# EAGLE design mosquino-power-rf (EAGLE 6.5.0)
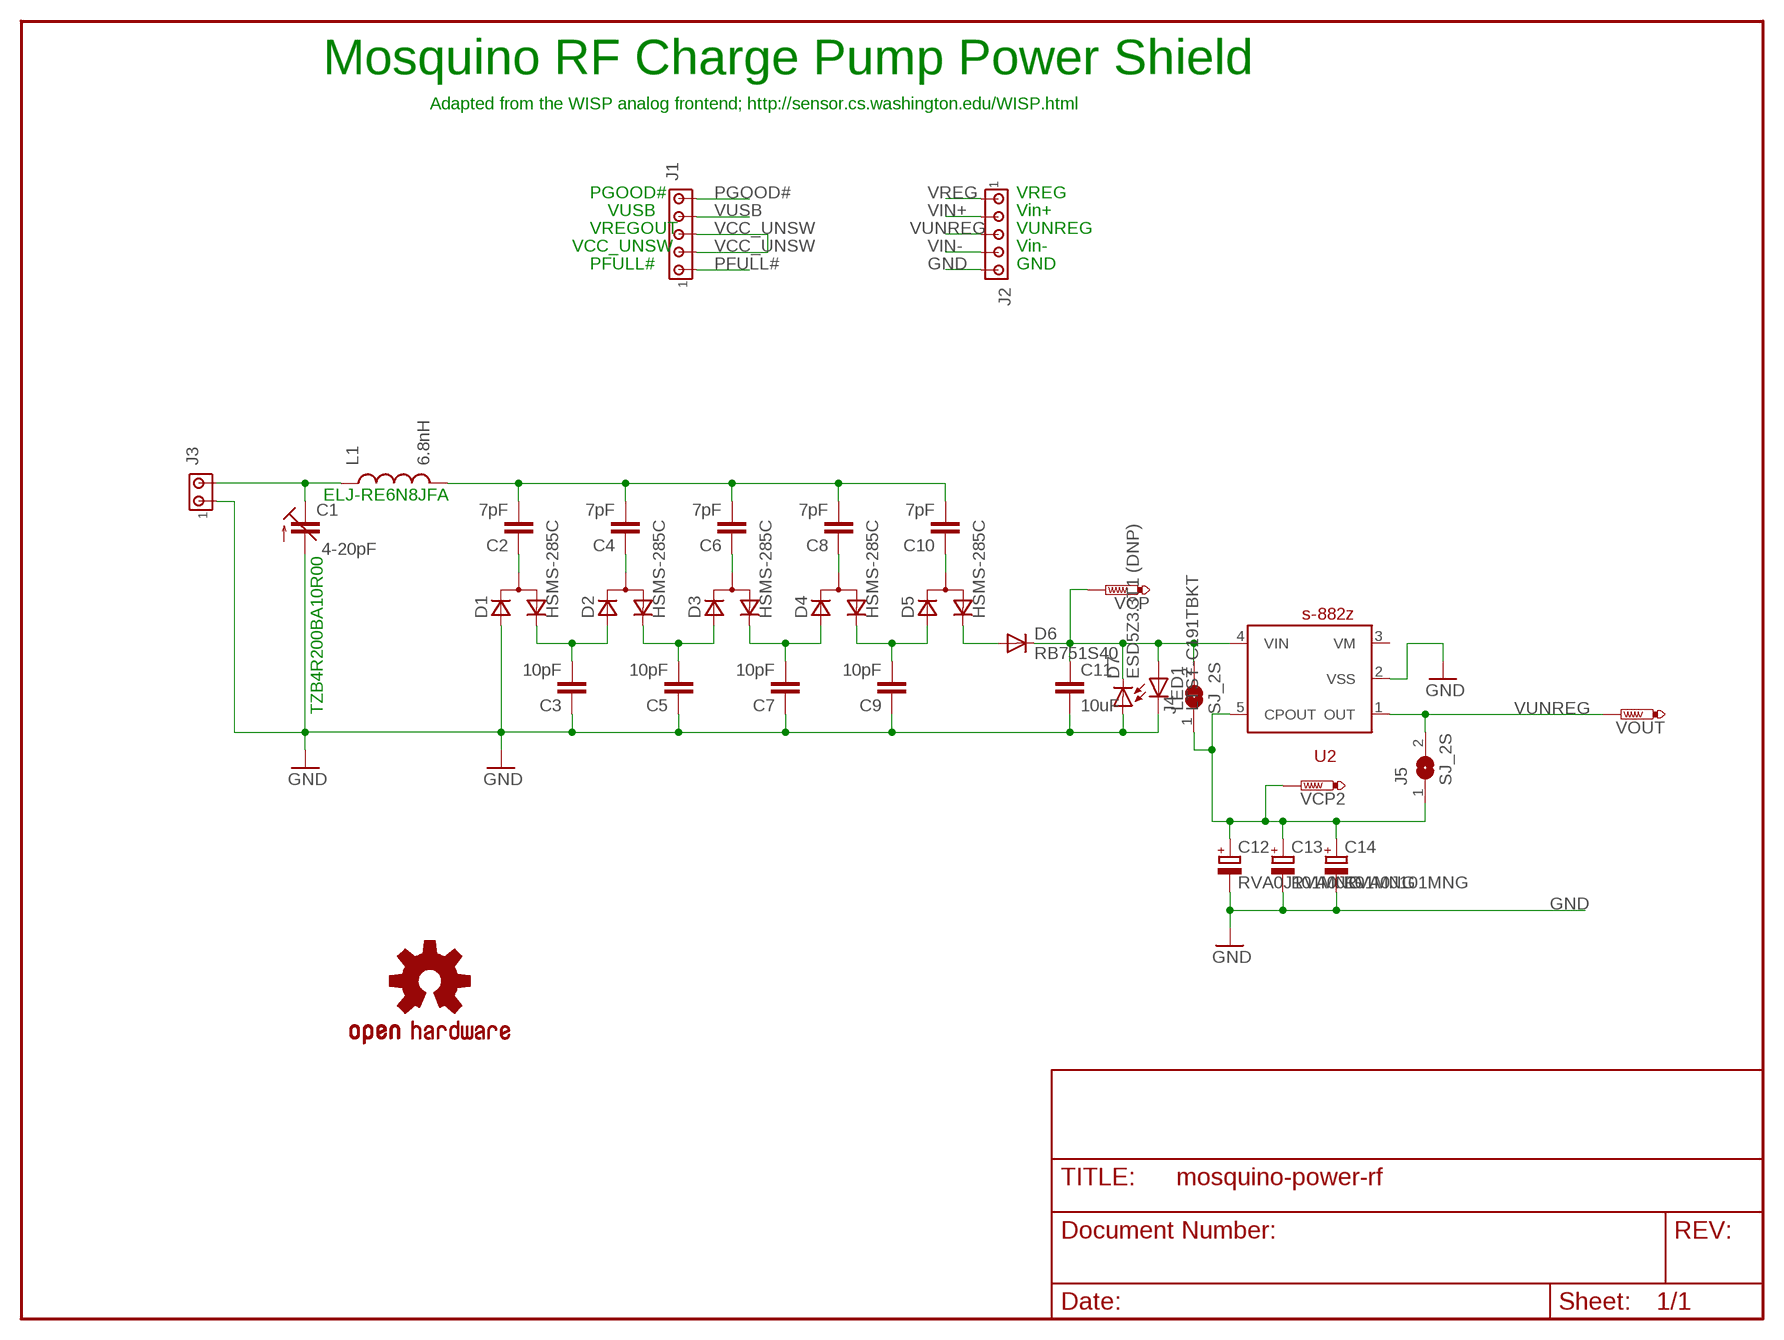
[diagram p0: schematic, sheet 1]

## Parts
C1  4-20pF  C-TRIMM3018_12  [CTRIM3018_12]
C2  7pF  C-EUC0603  [C0603]
C3  10pF  C-EUC0603  [C0603]
C4  7pF  C-EUC0603  [C0603]
C5  10pF  C-EUC0603  [C0603]
C6  7pF  C-EUC0603  [C0603]
C7  10pF  C-EUC0603  [C0603]
C8  7pF  C-EUC0603  [C0603]
C9  10pF  C-EUC0603  [C0603]
C10  7pF  C-EUC0603  [C0603]
C11  10uF  C-EUC0805  [C0805]
C12  RVA0J101MNG  CAP_TANT_D  [CASE_D]
C13  RVA0J101MNG  CAP_TANT_D  [CASE_D]
C14  RVA0J101MNG  CAP_TANT_D  [CASE_D]
D1  HSMS-285C  DIODE_DUAL_ACACSOT323  [SOT-323]
D2  HSMS-285C  DIODE_DUAL_ACACSOT323  [SOT-323]
D3  HSMS-285C  DIODE_DUAL_ACACSOT323  [SOT-323]
D4  HSMS-285C  DIODE_DUAL_ACACSOT323  [SOT-323]
D5  HSMS-285C  DIODE_DUAL_ACACSOT323  [SOT-323]
D6  RB751S40  DIODE-SOD523  [SOD523]
D7  ESD5Z3.3T1 (DNP)  DIODE-SOD523  [SOD523]
J1  MTA05-100  [10X05MTA]
J2  MTA05-100  [10X05MTA]
J3  MTA02-100  [10X02MTA]
J4  SJ_2S  [SJ2_S]
J5  SJ_2S  [SJ2_S]
L1  6.8nH  INDUCTOR0603  [0603]
LED1  LTST-C191TBKT  LEDCHIP-LED0603  [CHIP-LED0603]
LOGO1  OSHW-LOGOS  [OSHW-LOGO-S]
U2  s-882z  S-882Z  [SOT23-5]
VCP  PTR1PAD1-13  [P1-13]
VCP2  PTR1PAD1-13  [P1-13]
VOUT  PTR1PAD1-13  [P1-13]

## Nets
GND [pwr]: C1.-(A) C3.1 C5.1 C7.1 C9.1 C11.2 C12.2(-) C13.2(-) C14.2(-) D1.1(A) D7.A J2.5 J3.1 LED1.C U2.2(VSS)
N$1: C2.1 D1.3(CA)
N$2: C3.2 D1.2(C) D2.1(A)
N$3: C5.2 D2.2(C) D3.1(A)
N$4: C7.2 D3.2(C) D4.1(A)
N$5: C9.2 D4.2(C) D5.1(A)
N$6: C2.2 C4.2 C6.2 C8.2 C10.2 L1.2
N$7: C4.1 D2.3(CA)
N$8: C6.1 D3.3(CA)
N$9: C8.1 D4.3(CA)
N$10: C10.1 D5.3(CA)
N$11: D5.2(C) D6.A
N$12: C1.+(E) J3.2 L1.1
N$13: C11.1 D6.C D7.C J4.2 LED1.A U2.4(VIN) VCP.TP
N$15: C12.1(+) C13.1(+) C14.1(+) J4.1 J5.1 U2.5(CPOUT) VCP2.TP
PFULL#: J1.1
PGOOD#: J1.5
VCC_UNSW: J1.2 J1.3
VIN+ [pwr]: J2.2
VIN- [pwr]: J2.4
VREG [pwr]: J2.1
VUNREG: J2.3 J5.2 U2.1(OUT) VOUT.TP
VUSB: J1.4
Unconnected: U2.3(VM)

## Notes on the sheet
- Mosquino RF Charge Pump Power Shield
- Adapted from the WISP analog frontend; http://sensor.cs.washington.edu/WISP.html
- PGOOD# | VREG
- VUSB | Vin+
- VREGOUT | VUNREG
- VCC_UNSW | Vin-
- PFULL# | GND
- ELJ-RE6N8JFA
- TZB4R200BA10R00

## Library data of the parts
C1 = rcl:C-TRIMM: Trimm capacitor
C2-C11 = rcl:C-EU: CAPACITOR, European symbol
C12-C14 = mideeval:CAP_TANT_D
D1-D5 = tim:DIODE_DUAL_ACAC
D6 D7 = diode:DIODE-: DIODE
J1 J2 = con-amp:MTA05-100: AMP connector
J3 = con-amp:MTA02-100: AMP connector
J4 J5 = mideeval:SJ_2S: Small solder jumper, 2 pin. 20060130 / tgipson
L1 = SparkFun-Passives:INDUCTOR: Inductors Basic Inductor/Choke - 0603 and 1206. Footprints are not proven and vary greatly between part numbers. SRN6045- 33uH, 20% 1.4A
LED1 = led:LED: LED OSRAM: - CHIPLED LG R971, LG N971, LY N971, LG Q971, LY Q971, LO R971, LY R971 LH N974, LH R974 LS Q976, LO Q976, LY Q976 LO Q996 - Hyper CHIPLED LW Q18S LB Q993, LB Q99A, LB R99A - SideLED LS A670, LO A670, LY A670, LG A670, LP A670 LB A673, LV A673, LT A673, LW A673 LH A674 LY A675 LS A676, LA A676, LO A676, LY A676, LW A676 LS A679, LY A679, LG A679 - Hyper Micro SIDELED® LS Y876, LA Y876, LO Y876, LY Y876 LT Y87S - SmartLED LW L88C, LW L88S LB L89C, LB L89S, LG L890 LS L89K, LO L89K, LY L89K LS L896, LA L896, LO L896, LY L896 - TOPLED LS T670, LO T670, LY T670, LG T670, LP T670 LSG T670, LSP T670, LSY T670, LOP T670, LYG T670 LG T671, LOG T671, LSG T671 LB T673, LV T673, LT T673, LW T673 LH T674 LS T676, LA T676, LO T676, LY T676, LB T676, LH T676, LSB T676, LW T676 LB T67C, LV T67C, LT T67C, LS T67K, LO T67K, LY T67K, LW E67C LS E67B, LA E67B, LO E67B, LY E67B, LB E67C, LV E67C, LT E67C LW T67C LS T679, LY T679, LG T679 LS T770, LO T770, LY T770, LG T770, LP T770 LB T773, LV T773, LT T773, LW T773 LH T774 LS E675, LA E675, LY E675, LS T675 LS T776, LA T776, LO T776, LY T776, LB T776 LHGB T686 LT T68C, LB T68C - Hyper Mini TOPLED® LB M676 - Mini TOPLED Santana® LG M470 LS M47K, LO M47K, LY M47K Source: http://www.osram.convergy.de LUXEON: - LUMILED® LXK2-PW12-R00, LXK2-PW12-S00, LXK2-PW14-U00, LXK2-PW14-V00 LXK2-PM12-R00, LXK2-PM12-S00, LXK2-PM14-U00 LXK2-PE12-Q00, LXK2-PE12-R00, LXK2-PE12-S00, LXK2-PE14-T00, LXK2-PE14-U00 LXK2-PB12-K00, LXK2-PB12-L00, LXK2-PB12-M00, LXK2-PB14-N00, LXK2-PB14-P00, LXK2-PB14-Q00 LXK2-PR12-L00, LXK2-PR12-M00, LXK2-PR14-Q00, LXK2-PR14-R00 LXK2-PD12-Q00, LXK2-PD12-R00, LXK2-PD12-S00 LXK2-PH12-R00, LXK2-PH12-S00 LXK2-PL12-P00, LXK2-PL12-Q00, LXK2-PL12-R00 Source: www.luxeon.com KINGBRIGHT: KA-3528ASYC Source: www.kingbright.com
LOGO1 = SparkFun-Aesthetics:OSHW-LOGO: Open Source Hardware Logo This logo indicates the piece of hardware it is found on incorporates a OSHW license and/or adheres to the definition of open source hardware found here: http://freedomdefined.org/OSHW
U2 = tim:S-882Z: S-882Z series ultralow input voltage step-up converter. 20100817 / tgipson
VCP VCP2 VOUT = testpad:PTR1: TEST PIN

## Net classes
0 default: width 0.203 mm
1 pwr: width 0.203 mm, drill 0.381 mm, clearance 0.203 mm
4 digital: width 0.203 mm, drill 0.381 mm, clearance 0.203 mm

## Board
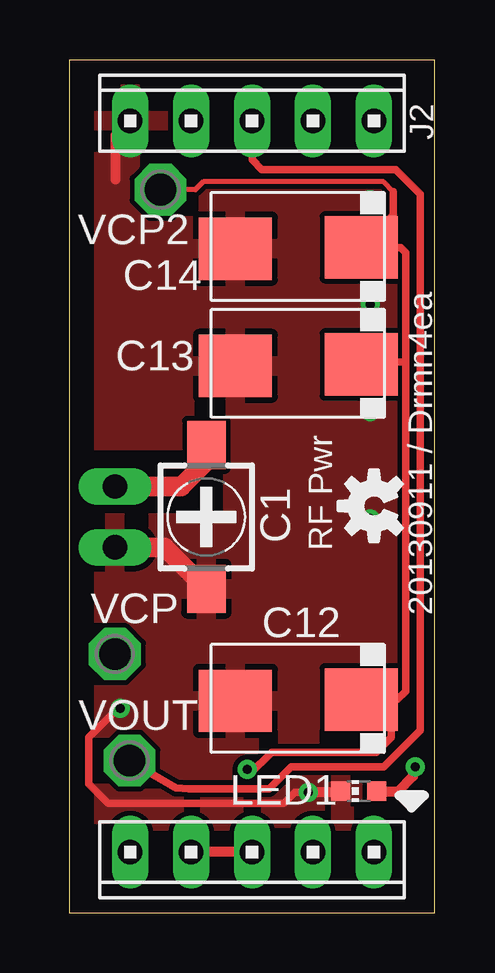
[diagram p1: board, top side]
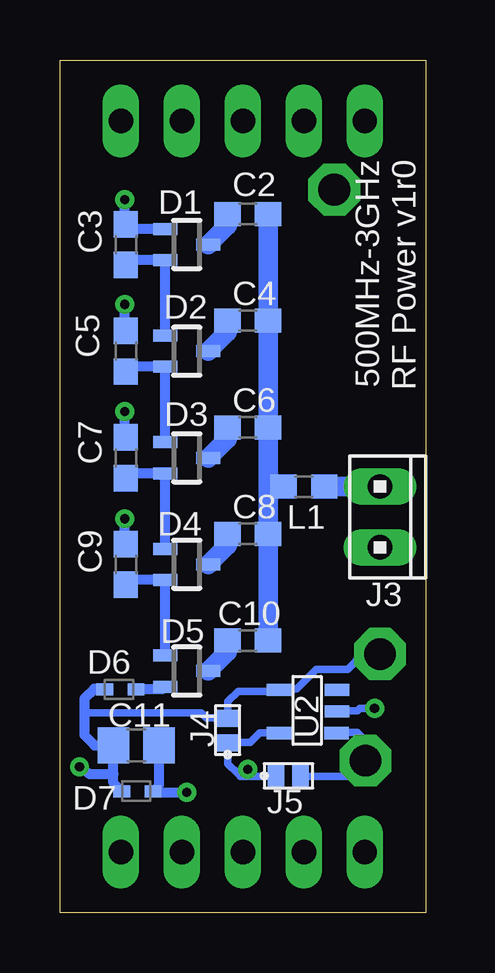
[diagram p2: board, bottom side, seen from below]

Size 15.24 x 35.56 mm. Coordinates in mm from the lower left corner, seen from the top.
Outline: 15.24,35.56 0,35.56 0,0 15.24,0 15.24,35.56
Copper layers (1*16): Top 0.035mm / dielectric 1.5mm / Bottom 0.035mm
Design rules "default": minimum track width 8mil, minimum drill 15mil, track to track 8mil, track to pad 8mil, pad to pad 8mil, via to via 8mil, smd to smd 8mil, copper to edge 40mil, drill to drill 8mil, minimum pad ring 10mil, minimum via ring 8mil, stop-mask expansion 4mil, vias tented up to drill 0mil, thermal gap 10mil

### Footprints (pad centres in the part's own frame; a part is rotated, then mirrored left to right if it is on the bottom)
CTRIM3018_12 = smd 2 x 1.6: + -3,0; - 3,0
C0603 = smd 1.1 x 1: 1 -0.85,0; 2 0.85,0
C0805 = smd 1.3 x 1.5: 1 -0.95,0; 2 0.95,0
CASE_D = smd 3.048 x 2.601: 1 -2.64,-0.01; 2 2.6,0.05
SOT-323 = smd 0.5 x 1: 1 -0.65,-0.9; 2 0.65,-0.9; 3 0,0.9
SOD523 = smd 0.7 x 0.5: A 0.7,0; C -0.6,0
10X05MTA = drill 1.016 long: 1 5.08,0; 2 2.54,0; 3 0,0; 4 -2.54,0; 5 -5.08,0
10X02MTA = drill 1.016 long: 1 1.27,0; 2 -1.27,0
SJ2_S = smd 0.7 x 0.9: 1 -0.523,0; 2 0.493,0
0603 = smd 1.1 x 1: 1 -0.85,0; 2 0.85,0
CHIP-LED0603 = smd 0.8 x 0.8: A 0,-0.75; C 0,0.75
SOT23-5 = smd 0.508 x 1.016: 1 -0.9,-1.2; 2 0,-1.21; 3 0.9,-1.21; 4 0.9,1.2; 5 -0.9,1.2
P1-13 = drill 1.321 pad 2.159 octagon: TP 0,0

### Placement (x,y rotation side)
C1  5.71,16.51 270 top
C2  7.42,29.13 0 bottom
C3  12.5,27.86 270 bottom
C4  7.42,24.69 0 bottom
C5  12.5,23.42 270 bottom
C6  7.42,20.24 0 bottom
C7  12.5,18.97 270 bottom
C8  7.42,15.8 0 bottom
C9  12.5,14.53 270 bottom
C10  7.42,11.35 0 bottom
C11  12.06,6.99 0 bottom
C12  9.53,8.89 180 top
C13  9.53,22.86 180 top
C14  9.53,27.74 180 top
D1  9.96,27.86 270 bottom
D2  9.96,23.42 270 bottom
D3  9.96,18.97 270 bottom
D4  9.96,14.53 270 bottom
D5  9.96,10.08 270 bottom
D6  12.78,9.32 0 bottom
D7  12.06,5.08 0 bottom
J1  7.62,2.54 180 top
J2  7.62,33.02 0 top
J3  1.91,16.51 270 bottom
J4  8.26,7.62 90 bottom
J5  5.71,5.71 0 bottom
L1  5.08,17.78 180 bottom
LED1  12.06,5.08 90 top
LOGO1  12.7,16.97 90 top
U2  4.92,8.4 90 bottom
VCP  1.91,10.79 0 top
VCP2  3.81,30.15 0 top
VOUT  2.51,6.35 0 top

### Tracks (layer width: path | path; a pad name or v marks a point on that pad's centre or on a via)
GND  (via drill 0.38)
  Top 0.305: 2.03,8.53 0.81,7.32 0.81,5.38 1.63,4.57 8.94,4.57 9.4,5.03 v9.96,5.03
  Top 0.406: LED1.C 11.26,5.03 v9.96,5.03 | J2.5 1.93,32.41 1.93,30.58
  Top 0.813: J3.1 3.98,15.24 C1.-
  Bottom 0.305: U2.2 3.67,8.43 2.85,8.43 2.74,8.53 v2.13,8.53
  Bottom 0.406: D1.1 12.3,28.51 C3.1 12.55,28.77 v12.55,29.74 | C5.1 12.55,24.32 v12.55,25.38 | C7.1 12.55,19.88 v12.55,20.9 | C9.1 12.55,15.43 v12.55,16.43 | C11.2 11.12,5.33 D7.A 11.31,5.03 v9.96,5.03
  pour Top: -2.24,38 17.58,38 17.58,-2.95 -2.24,-2.95
N$1
  Bottom 0.813: C2.1 8.27,28.65 D1.3
N$2
  Bottom 0.406: C3.2 12.3,27.21 D1.2 D2.1
N$3
  Bottom 0.406: C5.2 12.3,22.77 D2.2 D3.1
N$4
  Bottom 0.406: C7.2 12.3,18.32 D3.2 D4.1
N$5
  Bottom 0.406: C9.2 12.3,13.88 D4.2 D5.1
N$6
  Bottom 0.406: L1.2 6.57,17.78
  Bottom 0.813: C2.2 C4.2 C6.2 6.57,17.78 C8.2 C10.2
N$7
  Bottom 0.813: C4.1 8.27,24.21 D2.3
N$8
  Bottom 0.813: C6.1 8.27,19.76 D3.3
N$9
  Bottom 0.813: C8.1 8.27,15.32 D4.3
N$10
  Bottom 0.813: C10.1 8.27,10.87 D5.3
N$11
  Bottom 0.406: D5.2 10.97,9.32 D6.A
N$12
  Top 0.813: J3.2 4.67,17.78 5.71,18.82 C1.+
  Bottom 0.813: 2.33,17.78 J3.2 L1.1
N$13  (via drill 0.38)
  Top 0.406: LED1.A 13.72,5.08 14.33,5.69 v14.43,6.1
  Bottom 0.305: 14.22,8.33 9.35,8.33 9.14,8.13 8.27,8.13 J4.2 8.26,8.81 7.82,9.25 6.17,9.25 U2.4 6.07,9.35 5.38,9.35 4.57,10.16 3.25,10.16 2.62,10.79 VCP.TP
  Bottom 0.406: D6.C 13.4,9.35 13.82,9.35 14.22,8.94 14.22,8.33 14.22,7.42 13.79,6.99 C11.1 13.02,5.79 | D7.C 13.02,5.43 13.02,5.79 | v14.43,6.1 14.02,5.79 13.02,5.79
N$14
  cutout Top: 0.71,19.2 6.3,19.2 6.3,17.17 6.3,16.97 6.3,16.76 0.3,16.76 0,16.76 0,19.2
N$15  (via drill 0.38)
  Top 0.203: 13.51,30.07 13.11,30.48 5.59,30.48 5.26,30.15 VCP2.TP
  Top 0.305: 13.51,30.07 13.51,29.09 C14.1 12.18,27.74 13.82,27.74 14.02,27.53 14.02,22.96 | 14.02,22.96 14.02,9.25 13.68,8.9 C12.1 13.41,7.65 13.41,7.32 12.8,6.71 8.43,6.71 7.52,5.79 v7.42,5.99 | C13.1 12.26,22.96 14.02,22.96
  Bottom 0.305: U2.5 6.93,7.5 7.32,7.11 8.24,7.11 J4.1 8.26,6.22 7.82,5.79 | J5.1 6.26,5.69 7.72,5.69 7.82,5.79 | 7.82,5.79 v7.42,5.99
VCC_UNSW
  Top 0.406: J1.3 J1.2
VUNREG
  Top 0.305: J2.3 7.62,31.39 8.03,30.99 13.61,30.99 14.63,29.97 14.63,7.62 13.11,6.1 9.25,6.1 8.33,5.18 4.98,5.18 4.45,5.21 VOUT.TP
  Bottom 0.305: U2.1 3.7,7.52 2.85,7.52 1.91,6.58 VOUT.TP 2.29,6.35 2.95,5.69 5.2,5.69 J5.2

### Text on the board
tPlace: 20130911 / Drmn4ea | RF Pwr
bPlace: 500MHz-3GHz / RF Power v1r0
Document: GND | VIN- | VUNREG | VIN+ | VREG